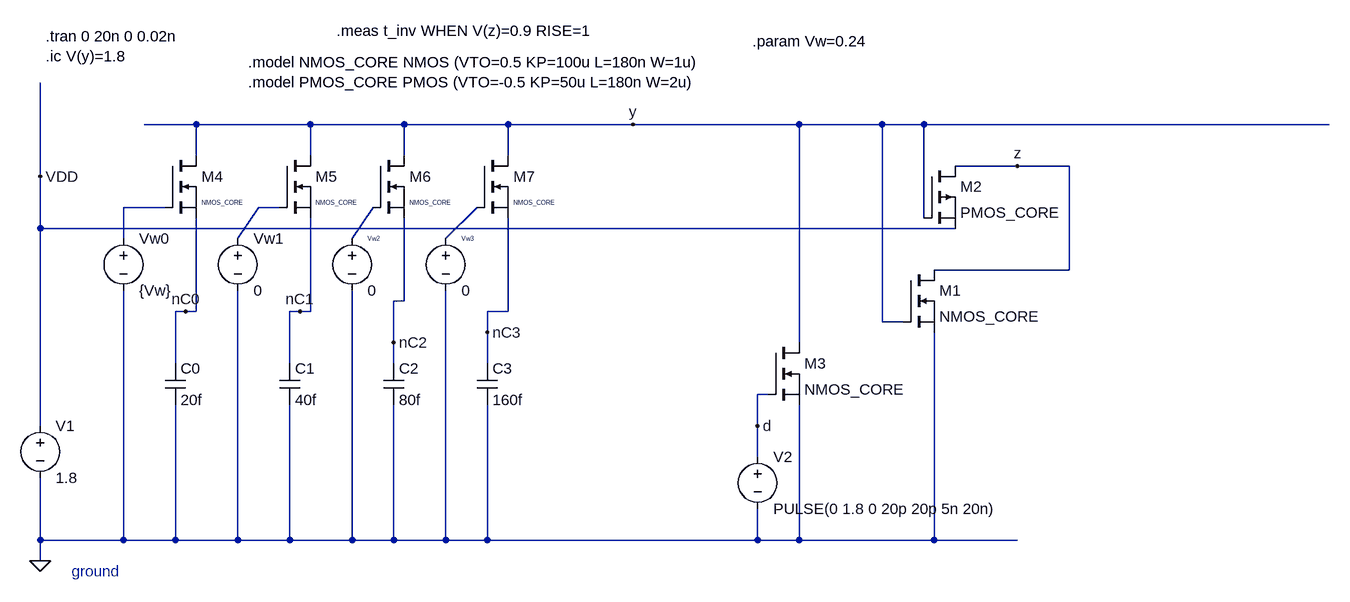
[diagram p0: schematic Single Cell Attempt 1.asc]
Single Cell Attempt 1.asc, the LTspice schematic file:
Version 4.1
SHEET 1 2300 1060
WIRE 400 80 320 80
WIRE 576 80 400 80
WIRE 720 80 576 80
WIRE 880 80 720 80
WIRE 1072 80 880 80
WIRE 1328 80 1072 80
WIRE 1456 80 1328 80
WIRE 1520 80 1456 80
WIRE 2144 80 1520 80
WIRE 400 128 400 80
WIRE 576 128 576 80
WIRE 720 128 720 80
WIRE 880 128 880 80
WIRE 1664 144 1568 144
WIRE 1744 144 1664 144
WIRE 160 160 160 16
WIRE 352 208 288 208
WIRE 528 208 496 208
WIRE 1520 224 1520 80
WIRE 160 240 160 160
WIRE 1568 240 160 240
WIRE 288 256 288 208
WIRE 464 256 496 208
WIRE 640 256 672 208
WIRE 784 256 832 208
WIRE 1744 304 1744 144
WIRE 1744 304 1536 304
WIRE 720 352 720 224
WIRE 720 352 704 352
WIRE 384 368 368 368
WIRE 400 368 400 224
WIRE 400 368 384 368
WIRE 560 368 544 368
WIRE 576 368 576 224
WIRE 576 368 560 368
WIRE 880 368 880 224
WIRE 880 368 848 368
WIRE 1456 384 1456 80
WIRE 1488 384 1456 384
WIRE 848 400 848 368
WIRE 704 416 704 352
WIRE 1328 416 1328 80
WIRE 368 448 368 368
WIRE 544 448 544 368
WIRE 704 448 704 416
WIRE 848 448 848 400
WIRE 1280 496 1264 496
WIRE 160 544 160 240
WIRE 1264 544 1264 496
WIRE 1264 592 1264 544
WIRE 160 720 160 624
WIRE 288 720 288 336
WIRE 288 720 160 720
WIRE 368 720 368 512
WIRE 368 720 288 720
WIRE 464 720 464 336
WIRE 464 720 368 720
WIRE 544 720 544 512
WIRE 544 720 464 720
WIRE 640 720 640 336
WIRE 640 720 544 720
WIRE 704 720 704 512
WIRE 704 720 640 720
WIRE 784 720 784 336
WIRE 784 720 704 720
WIRE 848 720 848 512
WIRE 848 720 784 720
WIRE 1264 720 1264 672
WIRE 1264 720 848 720
WIRE 1328 720 1328 512
WIRE 1328 720 1264 720
WIRE 1536 720 1536 400
WIRE 1536 720 1328 720
WIRE 1664 720 1536 720
WIRE 160 752 160 720
FLAG 160 160 VDD
FLAG 160 752 0
FLAG 1664 144 z
FLAG 1264 544 d
FLAG 1072 80 y
FLAG 384 368 nC0
FLAG 560 368 nC1
FLAG 704 416 nC2
FLAG 848 400 nC3
SYMBOL voltage 160 528 R0
WINDOW 123 0 0 Left 0
WINDOW 39 0 0 Left 0
SYMATTR InstName V1
SYMATTR Value 1.8
SYMBOL nmos 1488 304 R0
SYMATTR InstName M1
SYMATTR Value NMOS_CORE
SYMBOL pmos 1520 144 R0
SYMATTR InstName M2
SYMATTR Value PMOS_CORE
SYMBOL nmos 1280 416 R0
SYMATTR InstName M3
SYMATTR Value NMOS_CORE
SYMBOL voltage 1264 576 R0
WINDOW 123 0 0 Left 0
WINDOW 39 0 0 Left 0
SYMATTR InstName V2
SYMATTR Value PULSE(0 1.8 0 20p 20p 5n 20n)
SYMBOL nmos 528 128 R0
WINDOW 3 56 72 Left 0
SYMATTR Value NMOS_CORE
SYMATTR InstName M5
SYMBOL nmos 672 128 R0
WINDOW 3 56 72 Left 0
SYMATTR Value NMOS_CORE
SYMATTR InstName M6
SYMBOL nmos 832 128 R0
WINDOW 3 56 72 Left 0
SYMATTR Value NMOS_CORE
SYMATTR InstName M7
SYMBOL nmos 352 128 R0
WINDOW 3 56 72 Left 0
SYMATTR Value NMOS_CORE
SYMATTR InstName M4
SYMBOL cap 528 448 R0
SYMATTR InstName C1
SYMATTR Value 40f
SYMBOL cap 688 448 R0
SYMATTR InstName C2
SYMATTR Value 80f
SYMBOL cap 832 448 R0
SYMATTR InstName C3
SYMATTR Value 160f
SYMBOL cap 352 448 R0
SYMATTR InstName C0
SYMATTR Value 20f
SYMBOL voltage 288 240 R0
WINDOW 123 0 0 Left 0
WINDOW 39 0 0 Left 0
SYMATTR InstName Vw0
SYMATTR Value {Vw}
SYMBOL voltage 464 240 R0
WINDOW 123 0 0 Left 0
WINDOW 39 0 0 Left 0
SYMATTR InstName Vw1
SYMATTR Value 0
SYMBOL voltage 640 240 R0
WINDOW 0 24 16 Left 0
WINDOW 123 0 0 Left 0
WINDOW 39 0 0 Left 0
SYMATTR InstName Vw2
SYMATTR Value 0
SYMBOL voltage 784 240 R0
WINDOW 0 24 16 Left 0
WINDOW 123 0 0 Left 0
WINDOW 39 0 0 Left 0
SYMATTR InstName Vw3
SYMATTR Value 0
TEXT 208 768 Left 2 ;ground
TEXT 168 -56 Left 2 !.tran 0 20n 0 0.02n\n.ic V(y)=1.8
TEXT 480 -16 Left 2 !.model NMOS_CORE NMOS (VTO=0.5 KP=100u L=180n W=1u)\n.model PMOS_CORE PMOS (VTO=-0.5 KP=50u L=180n W=2u)
TEXT 616 -64 Left 2 !.meas t_inv WHEN V(z)=0.9 RISE=1
TEXT 1256 -48 Left 2 !.param Vw=0.24

The netlist it stands for:
* Single Cell Attempt 1.asc
V1 VDD 0 1.8
M1 z y 0 0 NMOS_CORE
M2 z y VDD VDD PMOS_CORE
M3 y d 0 0 NMOS_CORE
V2 d 0 PULSE(0 1.8 0 20p 20p 5n 20n)
M5 y N002 nC1 nC1 NMOS_CORE
M6 y N003 nC2 nC2 NMOS_CORE
M7 y N004 nC3 nC3 NMOS_CORE
M4 y N001 nC0 nC0 NMOS_CORE
C1 nC1 0 40f
C2 nC2 0 80f
C3 nC3 0 160f
C0 nC0 0 20f
Vw0 N001 0 {Vw}
Vw1 N002 0 0
Vw2 N003 0 0
Vw3 N004 0 0
.model NMOS NMOS
.model PMOS PMOS
.lib standard.mos
* ground
.tran 0 20n 0 0.02n
.ic V(y)=1.8
.model NMOS_CORE NMOS (VTO=0.5 KP=100u L=180n W=1u)
.model PMOS_CORE PMOS (VTO=-0.5 KP=50u L=180n W=2u)
.meas t_inv WHEN V(z)=0.9 RISE=1
.param Vw=0.24
.backanno
.end